# Altium schematic sheet [02] - Connectors.SchDoc: Connectors
size A3; Date: N.A.; ApprovedBy: N.A.; CheckedBy: N.A.; Author: N.A.; CompanyName: Johannes Berndorfer; DrawnBy: JBE; Organization: N.A.; Address1: Konrad Grefe Gasse 22; Address2: 1230 Wien; Address3: AUSTRIA; Address4: N.A.; DocumentNumber: 2; Revision: A; SheetNumber: 2; SheetTotal: 2; ProjectTitle: 10P50MIL Debugger Adapter Board; Reviewer: -; Time: N.A.; ImagePath: N.A.; Application_BuildNumber: N.A.
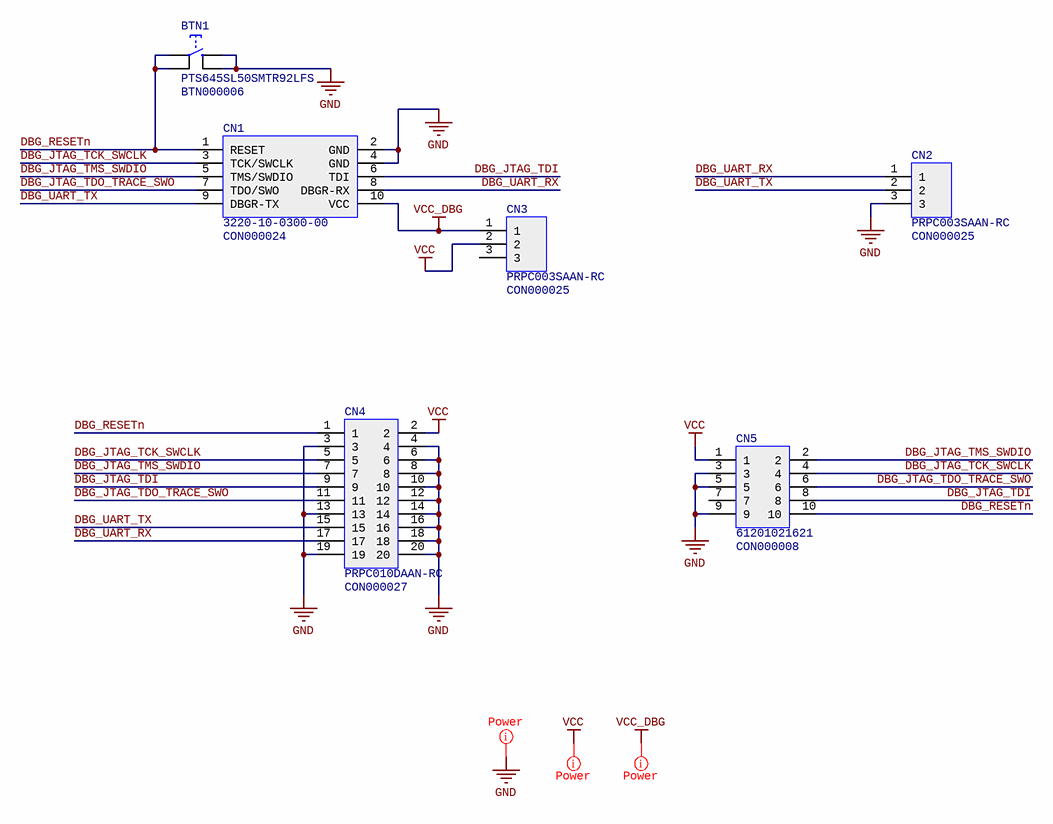
[diagram p0: [02] - Connectors.SchDoc]

## Parts
BTN1  PTS645SL50SMTR92LFS  Internal Part Number: BTN000006  [BTN-SMD-PTS645-CK]
CN1  3220-10-0300-00  Internal Part Number: CON000024  [CON-SMD-PINHEADER-SHIELDED-1.27MM-10POS-2X5-3220-10-0300-00-CNC-TECH]
CN2  PRPC003SAAN-RC  Internal Part Number: CON000025  [CON-THT-PINHEADER-2.54MM-3POS-1X3]
CN3  PRPC003SAAN-RC  Internal Part Number: CON000025  [CON-THT-PINHEADER-2.54MM-3POS-1X3]
CN4  PRPC010DAAN-RC  Internal Part Number: CON000027  [CON-THT-PINHEADER-2.54MM-20POS-2X10]
CN5  61201021621  Internal Part Number: CON000008  [CON-THT-PINHEADER-SHIELDED-2.54MM-10POS-61201021621-WURTH]

## Nets
GND: BTN1.3 BTN1.4 CN1.2(GND) CN1.4(GND) CN2.3 CN4.3 CN4.4 CN4.6 CN4.8 CN4.10 CN4.12 CN4.13 CN4.14 CN4.16 CN4.18 CN4.19 CN4.20 CN5.3 CN5.5 CN5.9
VCC: CN3.2 CN4.2 CN5.1
VCC_DBG: CN1.10(VCC) CN3.1
DBG_JTAG_TCK_SWCLK: CN1.3(TCK/SWCLK) CN4.5 CN5.4
DBG_JTAG_TDI: CN1.6(TDI) CN4.9 CN5.8
DBG_JTAG_TDO_TRACE_SWO: CN1.7(TDO/SWO) CN4.11 CN5.6
DBG_JTAG_TMS_SWDIO: CN1.5(TMS/SWDIO) CN4.7 CN5.2
DBG_RESETn: BTN1.1 BTN1.2 CN1.1(RESET) CN4.1 CN5.10
DBG_UART_RX: CN1.8(DBGR-RX) CN2.1 CN4.17
DBG_UART_TX: CN1.9(DBGR-TX) CN2.2 CN4.15

Not connected (* = marked no-connect by the designer): CN3 3; CN5 7

## Layout directives
net class Power: GND, VCC, VCC_DBG

## Notes on the sheet
- Labels drawn without touching a wire or pin: GND, VCC, VCC_DBG
- Title:
- Project:
- Document Nr.:
- Revision:
- Date:
- Drawn By:
- Time:
- Reviewed By:
- Sheet
- of
- Size:
- A3
- Variant:
- File:

## Library data of the parts
BTN1 = PTS645SL50SMTR92LFS: BTN TACT SPST-NO 12V 50mA SMD BLACK; Manufacturer: ITT C&K; Mechanical Life: 100000Cycles; Actuator Material: Nylon,Polyamide; Operating Force: 1.27N; Throw Configuration: SPST; Illumination Type: Non-Illuminated; Switch Function: Off-Mom; Actuator Type: Standard; Supplier 1: Digi-Key; Manufacturer Part Number: PTS645SL50SMTR92LFS; Stock 1: 127172; Pricing 1: 1 = 0,31000, 10 = 0,30000, 25 = 0,29000, 50 = 0,27960, 100 = 0,26410, 250 = 0,24860, 500 = 0,23822 (USD); RoHS: Yes; Mount: Surface Mount; Color: Black; Contact Plating: Silver; Contact Material: Bronze; Min Operating Temperature: -20°C; Max Operating Temperature: 60°C; Max Voltage Rating (DC): 12V; Current Rating: 50mA; Voltage Rating (DC): 12V; Packaging: Tape and Reel; Package Quantity: 1000; Max Current Rating: 50mA; Termination: Gull Wing; Orientation: Straight; Length: 6mm; Depth: 9mm; REACH SVHC: No SVHC; Lead Free: Lead Free; ComponentLink1URL: https://datasheet.ciiva.com/26927/getdatasheetpartid-760859-26927133.pdf?src-supplier=Verical; ComponentLink1Description: https://datasheet.ciiva.com/26927/getdatasheetpartid-760859-26927133.pdf?src-supplier=Verical; ComponentLink2URL: https://datasheet.ciiva.com/14920/pts645-14920742.pdf?src-supplier=Digi-Key; ComponentLink2Description: https://datasheet.ciiva.com/14920/pts645-14920742.pdf?src-supplier=Digi-Key; ComponentLink3URL: https://datasheet.ciiva.com/14920/pts645-14920743.pdf?src-supplier=Digi-Key; ComponentLink3Description: https://datasheet.ciiva.com/14920/pts645-14920743.pdf?src-supplier=Digi-Key; ComponentLink4URL: https://datasheet.ciiva.com/14920/pts645-14920744.pdf?src-supplier=Digi-Key; ComponentLink4Description: https://datasheet.ciiva.com/14920/pts645-14920744.pdf?src-supplier=Digi-Key; ComponentLink5URL: https://datasheet.ciiva.com/46429/1839862-46429337.pdf?src-supplier=Element14; ComponentLink5Description: https://datasheet.ciiva.com/46429/1839862-46429337.pdf?src-supplier=Element14; ComponentLink6URL: https://datasheet.ciiva.com/46429/1839862-46429338.pdf?src-supplier=Element14; ComponentLink6Description: https://datasheet.ciiva.com/46429/1839862-46429338.pdf?src-supplier=Element14; Supplier Part Number 1: CKN9088CT-ND
CN1 = 3220-10-0300-00: CON PINHDR SMD 1.27MM SHIELDED KEYED CNC TECH 10POS; Number of Positions: 10; Connector Type: Male Pin; Pitch: 0.05inch; Supplier 1: Digi-Key; Manufacturer 1: CNC Tech; Manufacturer Part Number 1: 3220-10-0300-00; Stock 1: 107713; Pricing 1: 1=0,74000, 10=0,69000, 100=0,52900, 500=0,46000, 3200=0,34500, 6400=0,33350, 12800=0,30590 (USD); RoHS: Yes; Mount: Surface Mount; Contact Plating: Gold; Package Quantity: 3200; Number of Rows: 2; Packaging: Tray; Termination: Solder; Row Spacing: 0.05inch; ComponentLink1URL: https://datasheet.ciiva.com/18655/3220-xx-0300-00-18655365.pdf?src-supplier=Digi-Key; ComponentLink1Description: https://datasheet.ciiva.com/18655/3220-xx-0300-00-18655365.pdf?src-supplier=Digi-Key; Supplier Part Number 1: 1175-1629-ND
CN2 CN3 = PRPC003SAAN-RC: CON PINHDR 2.54MM 1x03; Manufacturer: Sullins; Number of Positions: 3; Connector Type: Male Pin; Pitch: 0.1inch; Supplier 1: Digi-Key; Manufacturer Part Number: PRPC003SAAN-RC; Stock 1: 16923; Pricing 1: 1 = 0,12000, 10 = 0,10900, 25 = 0,08120, 50 = 0,06960, 100 = 0,06730, 250 = 0,05804, 500 = 0,05572 (USD); RoHS: Yes; Mount: Through Hole; Color: Black; Contact Plating: Gold; Package Quantity: 1; Number of Rows: 1; Packaging: Bulk; Termination: Solder; Contact Mating Length: 0.23inch; ComponentLink1URL: https://datasheet.ciiva.com/741/xrxczzzsxxn-rc-st-11635-b-741242.pdf?src-supplier=Digi-Key; ComponentLink1Description: https://datasheet.ciiva.com/741/xrxczzzsxxn-rc-st-11635-b-741242.pdf?src-supplier=Digi-Key; Supplier Part Number 1: S1011EC-03-ND
CN4 = PRPC010DAAN-RC: CON PINHDR 2.54MM 2x10; Manufacturer: Sullins; Number of Positions: 20; Connector Type: Male Pin; Pitch: 0.1inch; Supplier 1: Digi-Key; Manufacturer Part Number: PRPC010DAAN-RC; Stock 1: 2248; Pricing 1: 1 = 0,50000, 10 = 0,46400, 25 = 0,41800, 50 = 0,37160, 100 = 0,35600, 250 = 0,32508, 500 = 0,30960 (USD); RoHS: Yes; Mount: Through Hole; Color: Black; Contact Plating: Gold; Packaging: Bulk; Number of Rows: 2; Package Quantity: 1; Termination: Solder; Row Spacing: 0.1inch; Contact Mating Length: 0.23inch; ComponentLink1URL: https://datasheet.ciiva.com/741/xrxczzzdxxn-rc-11636-b-741275.pdf?src-supplier=Digi-Key; ComponentLink1Description: https://datasheet.ciiva.com/741/xrxczzzdxxn-rc-11636-b-741275.pdf?src-supplier=Digi-Key; Supplier Part Number 1: S2011EC-10-ND
CN5 = 61201021621: CON PINHDR 2.54MM SHIELDED 2x05 WURTH; Manufacturer: Wurth Electronics; Current Rating: 3A; Voltage Rating: 250V; Number of Positions: 10; Insulation Resistance: 1GR; Gender: Male; Connector Type: Male Pin; Row Spacing: 0.1inch; Supplier 1: Digi-Key; Manufacturer Part Number: 61201021621; Stock 1: 9556; Pricing 1: 1 = 0,45000, 10 = 0,43700, 50 = 0,40300, 100 = 0,36100, 260 = 0,31900, 520 = 0,31100 (USD); RoHS: Yes; Mount: Through Hole; Color: Black; Contact Material: Copper Alloy,Copper; Contact Plating: Gold; Housing Material: PBT; Min Operating Temperature: -40°C; Max Operating Temperature: 125°C; Package Quantity: 260; Number of Rows: 2; Packaging: Tray; Contact Gender: Male; Termination: Solder; Number of Contacts: 10; Orientation: Straight; Length: 9.1mm; Height: 8.85mm; Width: 20.36mm; Pitch: 2.54mm; REACH SVHC: Unknown; Lead Free: Lead Free; Flammability Rating: UL94 V-0; ComponentLink1URL: https://datasheet.ciiva.com/731/6120xx21621-731344.pdf?src-supplier=Digi-Key; ComponentLink1Description: https://datasheet.ciiva.com/731/6120xx21621-731344.pdf?src-supplier=Digi-Key; ComponentLink2URL: https://datasheet.ciiva.com/15395/6120xx21621-265834-15395106.pdf?src-supplier=Mouser; ComponentLink2Description: https://datasheet.ciiva.com/15395/6120xx21621-265834-15395106.pdf?src-supplier=Mouser; ComponentLink3URL: https://datasheet.ciiva.com/7648/76595-7648121.pdf?src-supplier=Element14; ComponentLink3Description: https://datasheet.ciiva.com/7648/76595-7648121.pdf?src-supplier=Element14; Supplier Part Number 1: 732-2094-ND